# Altium project ElectricSchema.PrjPCB
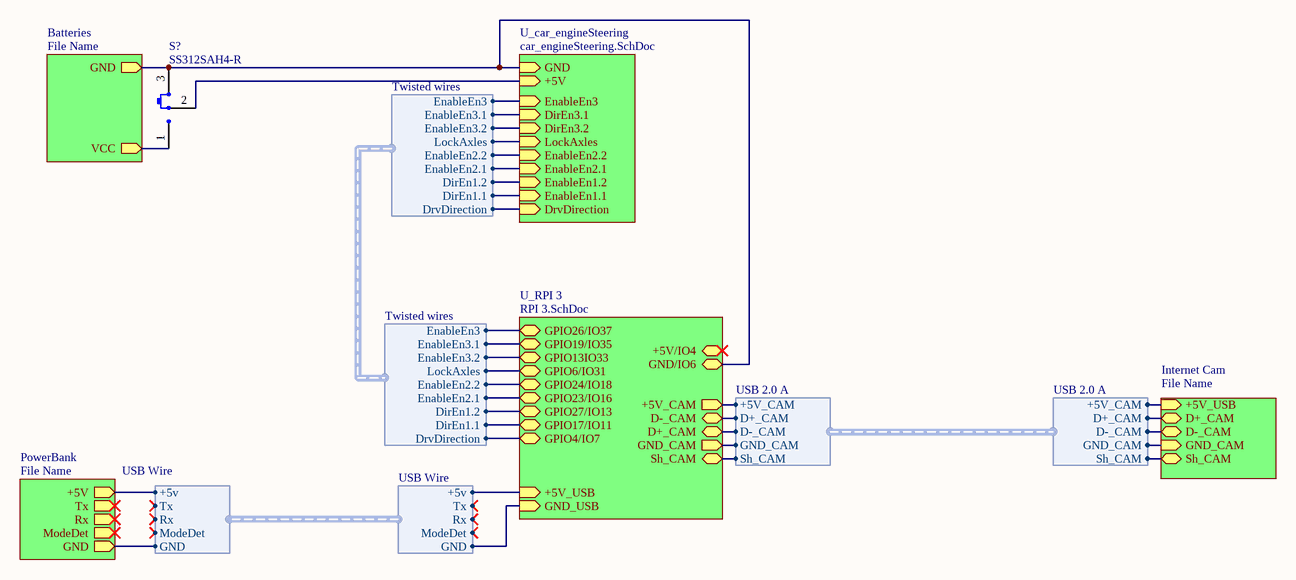
[diagram p0: ElectricSchema.SchDoc]
3 sheets, 53 parts. Net scope: hierarchical (ports join the sheet entries above them; power ports are global).
Board file: car_engineSteering.PcbDoc
Sheets:
  ElectricSchema.SchDoc
    U_car_engineSteering = car_engineSteering.SchDoc
    U_RPI 3 = RPI 3.SchDoc

## Sheet ElectricSchema.SchDoc
size A4

### Parts
S?  SS312SAH4-R  [NKK SS312SAH4]

### Sub-sheets
Batteries = File Name (file not in this document): VCC (out), GND (out)
Internet Cam = File Name (file not in this document): +5V_USB (in), D+_CAM (bidir), D-_CAM (bidir), GND_CAM (in), Sh_CAM (bidir)
PowerBank = File Name (file not in this document): Rx (out), +5V (out), ModeDet (out), GND (out), Tx (out)
U_car_engineSteering = car_engineSteering.SchDoc: EnableEn1.1 (in), EnableEn1.2 (in), EnableEn2.1 (in), EnableEn2.2 (in), LockAxles (in), DirEn3.1 (in), DirEn3.2 (in), EnableEn3 (in), DrvDirection (in), GND (in), +5V (in)
U_RPI 3 = RPI 3.SchDoc: GPIO4/IO7 (bidir), GPIO17/IO11 (bidir), GPIO27/IO13 (bidir), GPIO26/IO37 (bidir), GPIO13IO33 (bidir), GPIO6/IO31 (bidir), GPIO19/IO35 (bidir), GPIO23/IO16 (bidir), GPIO24/IO18 (bidir), GND/IO6 (bidir), +5V/IO4 (bidir), +5V_USB (in), GND_USB (in), +5V_CAM (out), D-_CAM (bidir), D+_CAM (bidir), GND_CAM (out), Sh_CAM (bidir)

### Harnesses
USB Wire: +5v, Tx, Rx, ModeDet, GND
Twisted wires: EnableEn3, DirEn1.1, DirEn1.2, LockAxles, EnableEn2.2, EnableEn2.1, EnableEn3.2, EnableEn3.1, DrvDirection
USB 2.0 A: +5V_CAM, D+_CAM, D-_CAM, GND_CAM, Sh_CAM

### Nets
GND: S?.3 ; sheet Batteries/GND, sheet PowerBank/GND, sheet U_car_engineSteering/GND, sheet U_RPI 3/GND/IO6, sheet U_RPI 3/GND_USB, harness USB Wire.GND
+5V: sheet U_car_engineSteering/DrvDirection, sheet U_RPI 3/GPIO4/IO7, harness Twisted wires.DrvDirection
DirEn3.1: sheet U_car_engineSteering/DirEn3.1, sheet U_RPI 3/GPIO19/IO35, harness Twisted wires.EnableEn3.1
DirEn3.2: sheet U_car_engineSteering/DirEn3.2, sheet U_RPI 3/GPIO13IO33, harness Twisted wires.EnableEn3.2
DrvDirection: S?.2(COM) ; sheet U_car_engineSteering/+5V
EnableEn1.1: sheet U_car_engineSteering/EnableEn1.1, sheet U_RPI 3/GPIO17/IO11, harness Twisted wires.DirEn1.1
EnableEn1.2: sheet U_car_engineSteering/EnableEn1.2, sheet U_RPI 3/GPIO27/IO13, harness Twisted wires.DirEn1.2
EnableEn2.1: sheet U_car_engineSteering/EnableEn2.1, sheet U_RPI 3/GPIO23/IO16, harness Twisted wires.EnableEn2.1
EnableEn2.2: sheet U_car_engineSteering/EnableEn2.2, sheet U_RPI 3/GPIO24/IO18, harness Twisted wires.EnableEn2.2
EnableEn3: sheet U_car_engineSteering/EnableEn3, sheet U_RPI 3/GPIO26/IO37, harness Twisted wires.EnableEn3
LockAxles: sheet U_car_engineSteering/LockAxles, sheet U_RPI 3/GPIO6/IO31, harness Twisted wires.LockAxles
NetJ?#1_1: sheet PowerBank/+5V, sheet U_RPI 3/+5V/IO4, sheet U_RPI 3/+5V_USB, harness USB Wire.+5v
NetJ?#1_2: sheet U_RPI 3/D-_CAM, sheet Internet Cam/D+_CAM, harness USB 2.0 A.D+_CAM
NetJ?#1_3: sheet U_RPI 3/D+_CAM, sheet Internet Cam/D-_CAM, harness USB 2.0 A.D-_CAM
NetJ?#1_4: sheet U_RPI 3/GND_CAM, sheet Internet Cam/GND_CAM, harness USB 2.0 A.GND_CAM
NetJ?#1_S: sheet U_RPI 3/Sh_CAM, sheet Internet Cam/Sh_CAM, harness USB 2.0 A.Sh_CAM
NetS?_1: S?.1 ; sheet Batteries/VCC
(unnamed): sheet U_RPI 3/+5V_CAM, sheet Internet Cam/+5V_USB, harness USB 2.0 A.+5V_CAM

### Library data of the parts
S? = SS312SAH4-R: SWITCH SLIDE SPDT 0.4VA 28V; Manufacturer: NKK Switches; Actuator Length: 2.00mm; Actuator Type: Standard; Contact Timing: Shorting (MBB); Current Rating (Amps): 0.4VA (AC/DC); Switch Function: On-On; Part Number: SS312SAH4-R; Circuit: SPDT; ComponentLink1Description: Datasheet; ComponentLink1URL: http://www.nkkswitches.com/pdf/SS3surfaceMount-1.pdf; ComponentLink2Description: DigiKey Link; ComponentLink2URL: http://digikey.com/product-detail/en/nkk-switches/SS312SAH4-R/360-2924-1-ND/1051215; Contact Finish: Gold; Contact Material: Phosphor Bronze; LastUpdated: 04.01.2020 19:10:14; Lifecycle Status: Active; Minimum Order: 1; Mounting Type: Surface Mount, Right Angle; Operating Temperature: -25°C ~ 85°C; Packaging: TapeAndReel; PartId: 1; Part Status: Active; Price: 1.95; Series: SS3; Supplier 1: DigiKey; Supplier Part Number 1: 360-2924-1-ND; Termination Style: Gull Wing; Voltage Rating - AC: 28V; Voltage Rating - DC: 28V

## Sheet car_engineSteering.SchDoc
size A4; SheetNumber: 1; SheetTotal: 2
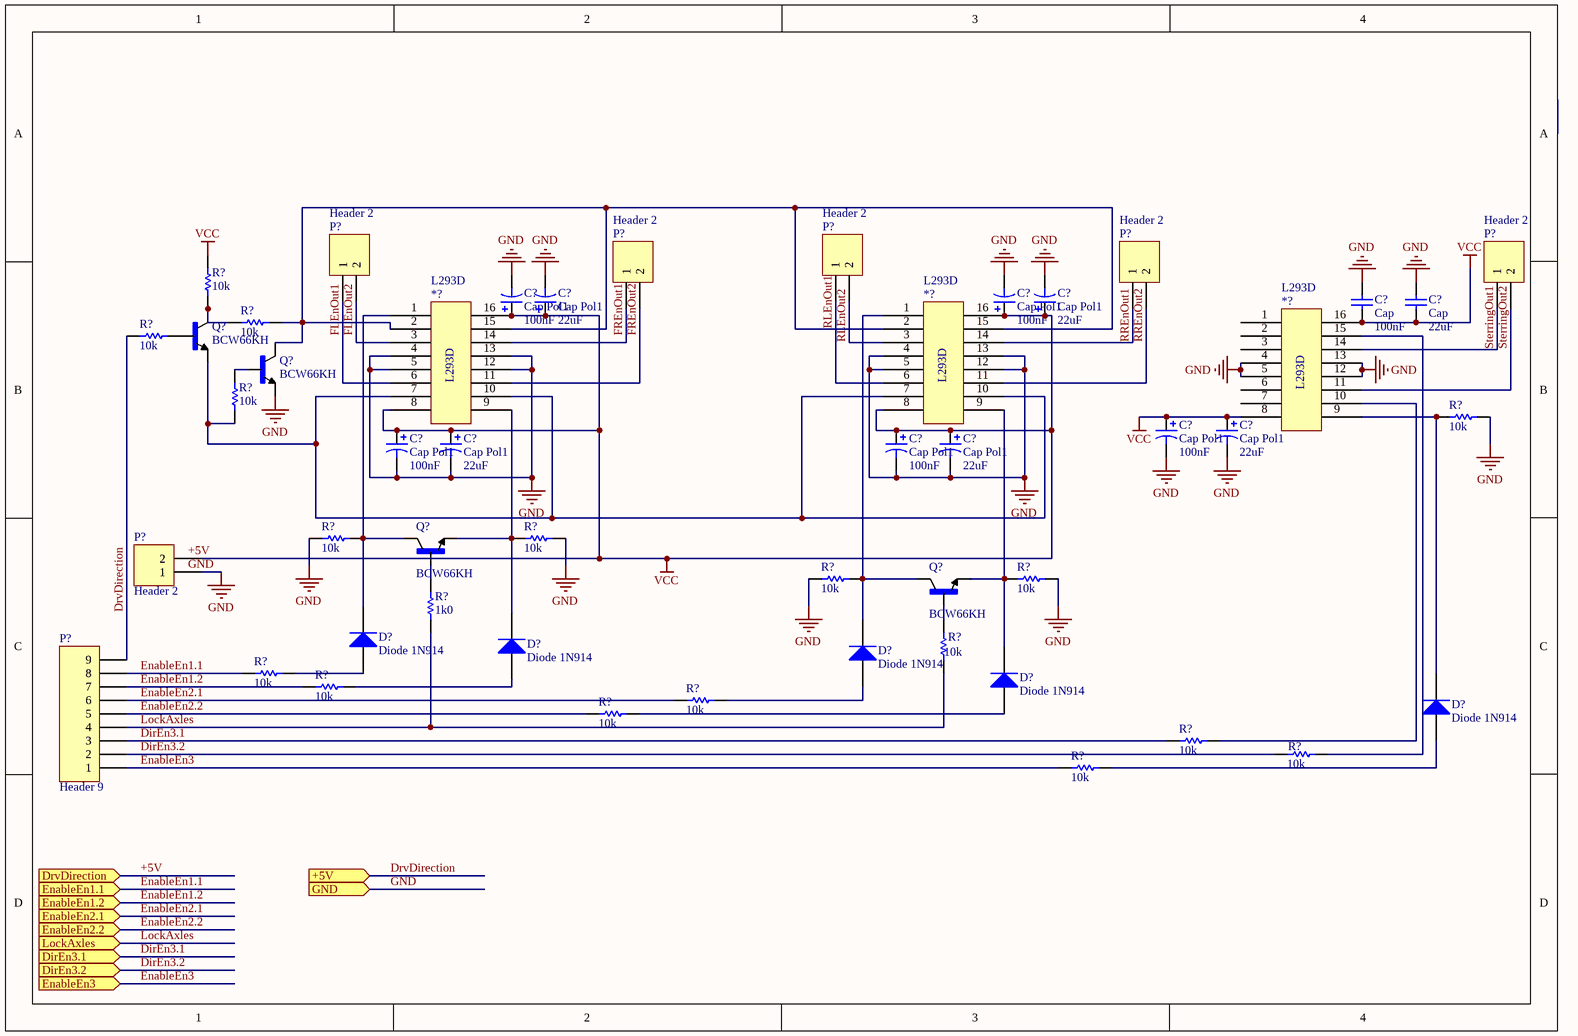
[diagram p1: car_engineSteering.SchDoc]

### Parts
(Parts that share a designator on the sheet are numbered #1, #2 ... from top to bottom, then left to right.)
*?#1  L293D  [DIP-16]
*?#2  L293D  [DIP-16]
*?#3  L293D  [DIP-16]
C?#1  Cap  value 100nF  [Cap_0603_HD]
C?#2  Cap  value 22uF  [Cap_0603_HD]
C?#3  Cap Pol1  value 100nF  [Cap_0603_HD]
C?#4  Cap Pol1  value 22uF  [Cap_0603_HD]
C?#5  Cap Pol1  value 100nF  [Cap_0603_HD]
C?#6  Cap Pol1  value 22uF  [Cap_0603_HD]
C?#7  Cap Pol1  value 100nF  [Cap_0603_HD]
C?#8  Cap Pol1  value 22uF  [Cap_0603_HD]
C?#9  Cap Pol1  value 100nF  [Cap_0603_HD]
C?#10  Cap Pol1  value 22uF  [Cap_0603_HD]
C?#11  Cap Pol1  value 100nF  [Cap_0603_HD]
C?#12  Cap Pol1  value 22uF  [Cap_0603_HD]
D?#1  Diode 1N914  [DO-35]
D?#2  Diode 1N914  [DO-35]
D?#3  Diode 1N914  [DO-35]
D?#4  Diode 1N914  [DO-35]
D?#5  Diode 1N914  [DO-35]
P?#1  Header 2  [HDR1X2]
P?#2  Header 2  [HDR1X2]
P?#3  Header 2  [HDR1X2]
P?#4  Header 2  [HDR1X2]
P?#5  Header 2  [HDR1X2]
P?#6  Header 2  [HDR1X2]
P?#7  Header 9  [HDR1X9]
Q?#1  BCW66KH  [TO-92A]
Q?#2  BCW66KH  [TO-92A]
Q?#3  BCW66KH  [TO-92A]
Q?#4  BCW66KH  [TO-92A]
R?#1  value 10k  [Res_0603_HD_outliine]  (hidden comment: Res)
R?#2  value 10k  [Res_0603_HD_outliine]  (hidden comment: Res)
R?#3  value 10k  [Res_0603_HD_outliine]  (hidden comment: Res)
R?#4  value 10k  [Res_0603_HD_outliine]  (hidden comment: Res)
R?#5  value 10k  [Res_0603_HD_outliine]  (hidden comment: Res)
R?#6  value 10k  [Res_0603_HD_outliine]  (hidden comment: Res)
R?#7  value 10k  [Res_0603_HD_outliine]  (hidden comment: Res)
R?#8  value 10k  [Res_0603_HD_outliine]  (hidden comment: Res)
R?#9  value 10k  [Res_0603_HD_outliine]  (hidden comment: Res)
R?#10  value 1k0  [Res_0603_HD_outliine]  (hidden comment: Res)
R?#11  value 10k  [Res_0603_HD_outliine]  (hidden comment: Res)
R?#12  value 10k  [Res_0603_HD_outliine]  (hidden comment: Res)
R?#13  value 10k  [Res_0603_HD_outliine]  (hidden comment: Res)
R?#14  value 10k  [Res_0603_HD_outliine]  (hidden comment: Res)
R?#15  value 10k  [Res_0603_HD_outliine]  (hidden comment: Res)
R?#16  value 10k  [Res_0603_HD_outliine]  (hidden comment: Res)
R?#17  value 10k  [Res_0603_HD_outliine]  (hidden comment: Res)
R?#18  value 10k  [Res_0603_HD_outliine]  (hidden comment: Res)

### Ports
+5V (in), DirEn3.1 (in), DirEn3.2 (in), DrvDirection (in), EnableEn1.1 (in), EnableEn1.2 (in), EnableEn2.1 (in), EnableEn2.2 (in), EnableEn3 (in), GND (in), LockAxles (in)

### Nets
GND: *?#1.4 *?#1.5 *?#1.12 *?#1.13 *?#2.4 *?#2.5 *?#2.12 *?#2.13 *?#3.4 *?#3.5 *?#3.12 *?#3.13 C?#1.1 C?#2.1 C?#3.2 C?#4.2 C?#5.2 C?#6.2 C?#7.2 C?#8.2 C?#9.2 C?#10.2 C?#11.2 C?#12.2 P?#6.1 Q?#2.1(B) R?#5.2 R?#6.1 R?#7.2 R?#8.1 R?#9.2 ; port GND
VCC: *?#1.8 *?#1.16 *?#2.8 *?#2.16 *?#3.8 *?#3.16 C?#1.2 C?#2.2 C?#3.1 C?#4.1 C?#5.1 C?#6.1 C?#7.1 C?#8.1 C?#9.1 C?#10.1 C?#11.1 C?#12.1 P?#6.2 R?#1.2
DirEn3.1: P?#7.3 R?#16.1 ; port DirEn3.1
DirEn3.2: P?#7.2 R?#17.1 ; port DirEn3.2
DrvDirection: P?#7.9 R?#3.2 ; port +5V
EnableEn1.1: P?#7.8 R?#12.1 ; port EnableEn1.1
EnableEn1.2: P?#7.7 R?#13.1 ; port EnableEn1.2
EnableEn2.1: P?#7.6 R?#14.1 ; port EnableEn2.1
EnableEn2.2: P?#7.5 R?#15.1 ; port EnableEn2.2
EnableEn3: P?#7.1 R?#18.1 ; port EnableEn3
FLEnOut1: *?#1.6 P?#1.1
FLEnOut2: *?#1.3 P?#1.2
FREnOut1: *?#1.14 P?#3.1
FREnOut2: *?#1.11 P?#3.2
LockAxles: P?#7.4 R?#10.2 R?#11.2 ; port LockAxles
RLEnOut1: *?#1.2 *?#1.15 *?#2.2 *?#2.6 *?#2.15 P?#2.1 Q?#2.3(C) R?#2.1
RLEnOut2: *?#2.3 P?#2.2
RREnOut1: *?#2.14 P?#4.1
RREnOut2: *?#2.11 P?#4.2
SterringOut1: *?#3.14 P?#5.1
SterringOut2: *?#3.11 P?#5.2
Net*?#1_1: *?#1.1 D?#1.2(K) Q?#3.3(C) R?#6.2
Net*?#1_7: *?#1.7 *?#1.10 *?#2.7 *?#2.10 Q?#1.1(B) R?#4.2
Net*?#1_9: *?#1.9 D?#2.2(K) Q?#3.1(B) R?#7.1
Net*?#2_1: *?#2.1 D?#3.2(K) Q?#4.3(C) R?#8.2
Net*?#2_9: *?#2.9 D?#4.2(K) Q?#4.1(B) R?#9.1
Net*?#3_9: *?#3.9 D?#5.2(K) R?#5.1
Net*?#3_10: *?#3.10 R?#16.2
Net*?#3_15: *?#3.15 R?#17.2
NetD?#1_1: D?#1.1(A) R?#12.2
NetD?#2_1: D?#2.1(A) R?#13.2
NetD?#3_1: D?#3.1(A) R?#14.2
NetD?#4_1: D?#4.1(A) R?#15.2
NetD?#5_1: D?#5.1(A) R?#18.2
NetQ?#1_2: Q?#1.2(E) R?#3.1
NetQ?#1_3: Q?#1.3(C) R?#1.1 R?#2.2
NetQ?#2_2: Q?#2.2(E) R?#4.1
NetQ?#3_2: Q?#3.2(E) R?#10.1
NetQ?#4_2: Q?#4.2(E) R?#11.1

Not connected (* = marked no-connect by the designer): *?#3 1 2 3 6 7

### Notes on the sheet
- Labels drawn without touching a wire or pin: +5V, GND

### Library data of the parts
*?#1-*?#3 = L293D: H-bridge driver
C?#1 C?#2 = Cap: Capacitor; Published: 8-Jun-2000; LatestRevisionDate: 17-Jul-2002; LatestRevisionNote: Re-released for DXP Platform.; PackageReference: RAD-0.3; Publisher: Altium Limited; PackageDescription: Radial Cap, Thru-Hole; 2 Leads; 0.3 in Pin Spacing
C?#3-C?#12 = Cap Pol1: Polarized Capacitor (Radial); Published: 8-Jun-2000; LatestRevisionDate: 17-Jul-2002; LatestRevisionNote: Re-released for DXP Platform.; PackageReference: RB7.6-15; Publisher: Altium Limited; PackageDescription: Polarized Capacitor (Radial); 2 Leads
D?#1-D?#5 = Diode 1N914: High Conductance Fast Diode; Published: 8-Jun-2000; LatestRevisionDate: 17-Jul-2002; LatestRevisionNote: Re-released for DXP Platform.; DatasheetVersion: 1997; PackageReference: DO-35; Publisher: Altium Limited; PackageDescription: Diode, Axial; Body 3.8 x 1.9 mm (LxDia. max), Lead Dia. 0.53 mm (max); Code_JEDEC: DO-204-AH; ComponentLink1Description: Manufacturer Link; ComponentLink1URL: http://www.fairchildsemi.com/; ComponentLink2Description: Datasheet; ComponentLink2URL: http://www.fairchildsemi.com/ds/1N%2F1N4448.pdf
P?#1-P?#6 = Header 2: Header, 2-Pin; LatestRevisionDate: 17-Jul-2002; LatestRevisionNote: Re-released for DXP Platform.; Publisher: Altium Limited
P?#7 = Header 9: Header, 9-Pin; LatestRevisionDate: 17-Jul-2002; LatestRevisionNote: Re-released for DXP Platform.; Publisher: Altium Limited
Q?#1-Q?#4 = BCW66KHE6327: NPN Transistor
R?#1-R?#18 = Res: Resistor

## Sheet RPI 3.SchDoc
size A4; SheetNumber: 1; SheetTotal: 1
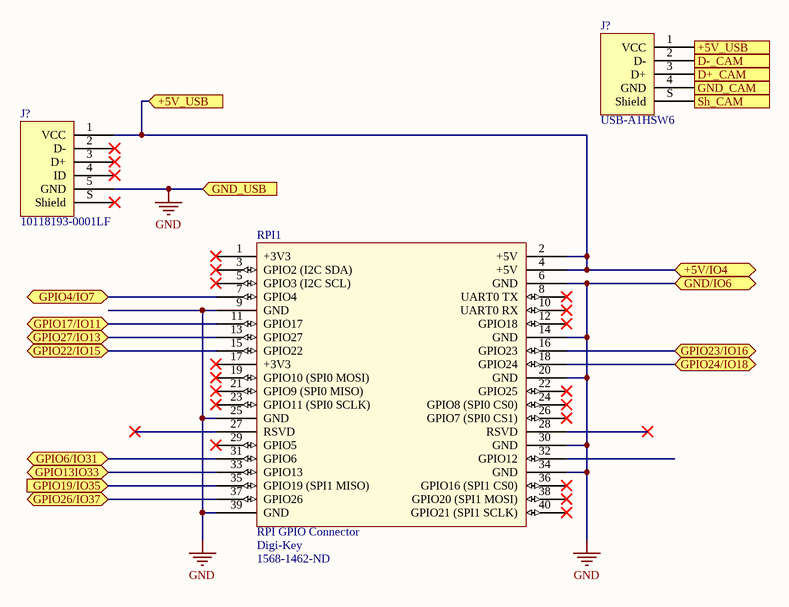
[diagram p2: RPI 3.SchDoc]

### Parts
(Parts that share a designator on the sheet are numbered #1, #2 ... from top to bottom, then left to right.)
J?#1  USB-A1HSW6  [ON SHORE TECHNOLOGY USB-A1HSW6]
J?#2  10118193-0001LF  [FCI USB 10118193-0001LF]
RPI1  RPI GPIO Connector  Supplier 1: Digi-Key  Supplier Part Number 1: 1568-1462-ND  [rpi]

### Ports
+5V/IO4 (bidir), +5V_USB (in), D+_CAM (in), D-_CAM (in), GND/IO6 (bidir), GND_CAM (in), GND_USB (in), GPIO4/IO7 (bidir), GPIO6/IO31 (bidir), GPIO13IO33 (bidir), GPIO17/IO11 (bidir), GPIO19/IO35 (in), GPIO22/IO15 (bidir), GPIO23/IO16 (bidir), GPIO24/IO18 (bidir), GPIO26/IO37 (bidir), GPIO27/IO13 (bidir), Sh_CAM (in)

### Nets
GND: J?#2.5(GND) RPI1.6(GND) RPI1.9(GND) RPI1.14(GND) RPI1.20(GND) RPI1.25(GND) RPI1.30(GND) RPI1.34(GND) RPI1.39(GND) ; port GND/IO6, port GND_USB
+5V: RPI1.7(GPIO4) ; port GPIO4/IO7
DirEn3.1: RPI1.35(GPIO19_(SPI1_MISO)) ; port GPIO19/IO35
DirEn3.2: RPI1.33(GPIO13) ; port GPIO13IO33
EnableEn1.1: RPI1.11(GPIO17) ; port GPIO17/IO11
EnableEn1.2: RPI1.13(GPIO27) ; port GPIO27/IO13
EnableEn2.1: RPI1.16(GPIO23) ; port GPIO23/IO16
EnableEn2.2: RPI1.18(GPIO24) ; port GPIO24/IO18
EnableEn3: RPI1.37(GPIO26) ; port GPIO26/IO37
LockAxles: RPI1.31(GPIO6) ; port GPIO6/IO31
NetJ?#1_1: J?#1.1(VCC) J?#2.1(VCC) RPI1.2(+5V) RPI1.4(+5V) ; port +5V/IO4, port +5V_USB
NetJ?#1_2: J?#1.2(D-) ; port D-_CAM
NetJ?#1_3: J?#1.3(D+) ; port D+_CAM
NetJ?#1_4: J?#1.4(GND) ; port GND_CAM
NetJ?#1_S: J?#1.S(Shield) ; port Sh_CAM
NetRPI1_15: RPI1.15(GPIO22) ; port GPIO22/IO15

Not connected (* = marked no-connect by the designer): J?#2 2(D-)* 3(D+)* 4(ID)* S(Shield)*; RPI1 1(+3V3)* 3(GPIO2_(I2C_SDA))* 5(GPIO3_(I2C_SCL))* 8(UART0_TX)* 10(UART0_RX)* 12(GPIO18)* 17(+3V3)* 19(GPIO10_(SPI0_MOSI))* 21(GPIO9_(SPI0_MISO))* 22(GPIO25)* 23(GPIO11_(SPI0_SCLK))* 24(GPIO8_(SPI0_CS0))* 26(GPIO7_(SPI0_CS1))* 27(RSVD)* 28(RSVD)* 29(GPIO5)* 32(GPIO12) 36(GPIO16_(SPI1_CS0))* 38(GPIO20_(SPI1_MOSI))* 40(GPIO21_(SPI1_SCLK))*

### Library data of the parts
J?#1 = USB-A1HSW6: CONN RCPT TYPEA 4POS R/A; Manufacturer: On Shore Technology Inc.; Connector Type: USB - A; Current Rating (Amps): 1A; Gender: Receptacle; Number of Contacts: 4; Number of Ports: 1; Shielding: Unshielded; Voltage - Rated: 30VAC; Part Number: USB-A1HSW6; ComponentLink1Description: Datasheet; ComponentLink1URL: http://www.on-shore.com/wp-content/uploads/USB-A1HSXX.pdf; ComponentLink2Description: DigiKey Link; ComponentLink2URL: http://digikey.com/product-detail/en/on-shore-technology-inc/USB-A1HSW6/ED2989-ND/2677750; Features: Board Lock; LastUpdated: 30.04.2020 11:56:44; Lifecycle Status: Active; Minimum Order: 1; Mounting Feature: Horizontal; Mounting Type: Through Hole, Right Angle; Operating Temperature: 0°C ~ 85°C; Packaging: Tray; Part Status: Active; Price: 0.48; Series: -; Supplier 1: DigiKey; Supplier Part Number 1: ED2989-ND; Termination: Solder
J?#2 = 10118193-0001LF: CONN RCPT USB2.0 MICRO B SMD R/A; Manufacturer: Amphenol ICC (FCI); Connector Type: USB - micro B; Current Rating (Amps): 1.8A per Contact; Gender: Receptacle; Mating Cycles: 10000; Number of Contacts: 5; Number of Ports: 1; Shielding: Shielded; Voltage - Rated: 100VAC; Part Number: 10118193-0001LF; ComponentLink1Description: Datasheet; ComponentLink1URL: https://cdn.amphenol-icc.com/media/wysiwyg/files/documentation/datasheet/inputoutput/io_usb_micro.pdf; ComponentLink2Description: DigiKey Link; ComponentLink2URL: //digikey.com/product-detail/en/amphenol-icc-fci/10118193-0001LF/609-4616-2-ND/2785388; Features: Solder Retention; LastUpdated: 09.12.2019 20:51:28; Lifecycle Status: 0; Minimum Order: 1; Mounting Feature: Horizontal; Mounting Type: Surface Mount, Right Angle; Through Hole; Operating Temperature: -30°C ~ 80°C; Packaging: TapeAndReel; Part Status: Active; Price: 0.21; Series: -; Specifications: USB 2.0; Supplier 1: DigiKey; Supplier Part Number 1: 609-4616-2-ND; Termination: Solder
RPI1 = rpi connector: GPIO Header for Raspberry Pi A+/B+/Pi 2/Pi 3 - 2x20; Manufacturer: SparkFun Electronics; Manufacturer Part Number: PRT-14017; Nils Minor: author; nilsminor@web.de: mail; RoHS: RoHS Compliant; Category: Development Boards, Kits, Programmers; Stock 1: 150; Pricing 1: 1=1.84 (EUR); Part Status: Active; Accessory Type: Connector; For Use With/Related Products: Raspberry Pi; ComponentLink1URL: https://cdn.sparkfun.com/datasheets/Dev/RaspberryPi/12313.pdf; ComponentLink1Description: https://cdn.sparkfun.com/datasheets/Dev/RaspberryPi/12313.pdf

## Nets that join several sheets
GND: ElectricSchema (S?.3), car_engineSteering (31 pins), RPI 3 (9 pins)
DirEn3.1: car_engineSteering (P?#7.3 R?#16.1), RPI 3 (RPI1.35)
DirEn3.2: car_engineSteering (P?#7.2 R?#17.1), RPI 3 (RPI1.33)
DrvDirection: ElectricSchema (S?.2), car_engineSteering (P?#7.9 R?#3.2)
EnableEn1.1: car_engineSteering (P?#7.8 R?#12.1), RPI 3 (RPI1.11)
EnableEn1.2: car_engineSteering (P?#7.7 R?#13.1), RPI 3 (RPI1.13)
EnableEn2.1: car_engineSteering (P?#7.6 R?#14.1), RPI 3 (RPI1.16)
EnableEn2.2: car_engineSteering (P?#7.5 R?#15.1), RPI 3 (RPI1.18)
EnableEn3: car_engineSteering (P?#7.1 R?#18.1), RPI 3 (RPI1.37)
LockAxles: car_engineSteering (P?#7.4 R?#10.2 R?#11.2), RPI 3 (RPI1.31)